# EAGLE design ATMega8Motherboard (EAGLE 6.2)
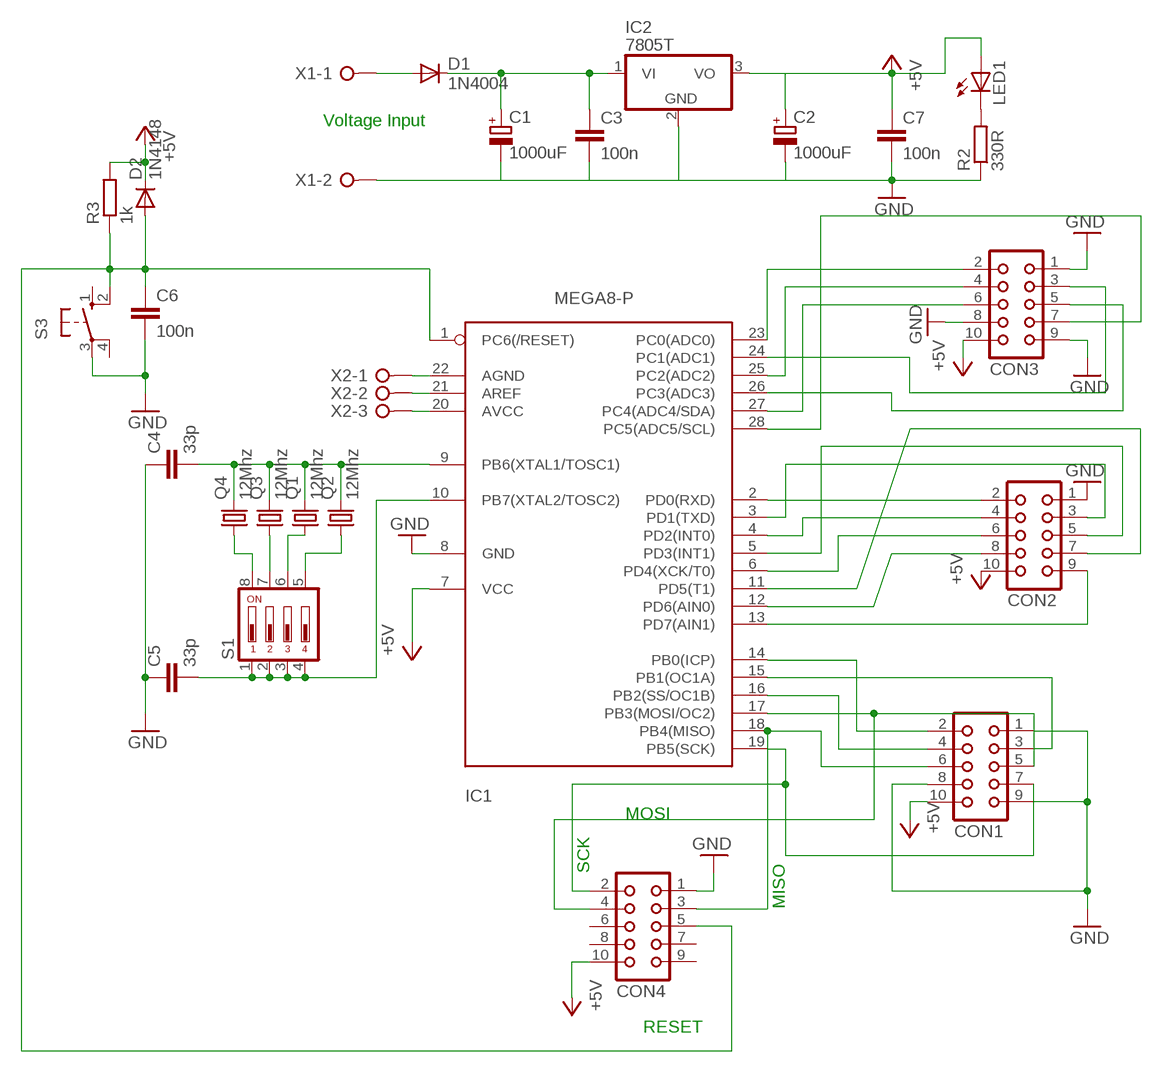
[diagram p0: schematic, sheet 1]

## Parts
C1  1000uF  CPOL-EUE2.5-7  [E2,5-7]
C2  1000uF  CPOL-EUE2.5-7  [E2,5-7]
C3  100n  C-EU025-024X044  [C025-024X044]
C4  33p  C-EU025-024X044  [C025-024X044]
C5  33p  C-EU025-024X044  [C025-024X044]
C6  100n  C-EU025-024X044  [C025-024X044]
C7  100n  C-EU025-024X044  [C025-024X044]
CON1  CON10  [CON10]
CON2  CON10  [CON10]
CON3  CON10  [CON10]
CON4  CON10  [CON10]
D1  1N4004  [DO41-10]
D2  1N4148  [DO35-10]
IC1  MEGA8-P  [DIL28-3]
IC2  7805T  [TO220H]
LED1  LED5MM  [LED5MM]
Q1  12Mhz  CRYSTALHC18U-V  [HC18U-V]
Q2  12Mhz  CRYSTALHC18U-V  [HC18U-V]
Q3  12Mhz  CRYSTALHC18U-V  [HC18U-V]
Q4  12Mhz  CRYSTALHC18U-V  [HC18U-V]
R2  330R  R-EU_0204/5  [0204/5]
R3  1k  R-EU_0204/5  [0204/5]
S1  DIP04YL  [DIP04YL]
S3  10-XX  [B3F-10XX]
X1  W237-02P  [W237-132]
X2  W237-03P  [W237-133]

## Nets
+5V: C2.+ C7.1 CON1.10 CON2.10 CON3.10 CON4.10 D2.C IC1.7(VCC) IC2.3(VO) LED1.A R3.2
GND: C1.- C2.- C3.2 C4.1 C5.1 C6.2 C7.2 CON1.1 CON1.8 CON1.9 CON2.1 CON3.1 CON3.8 CON3.9 CON4.1 IC1.8(GND) IC2.2(GND) R2.1 S3.3(P) X1.2
N$1: D1.A X1.1
N$2: C1.+ C3.1 D1.C IC2.1(VI)
N$3: CON1.3 IC1.15(PB1(OC1A))
N$4: CON2.2 IC1.2(PD0(RXD))
N$5: CON2.3 IC1.3(PD1(TXD))
N$6: CON1.2 IC1.14(PB0(ICP))
N$7: IC1.22(AGND) X2.1
N$8: CON2.4 IC1.4(PD2(INT0))
N$9: CON2.5 IC1.5(PD3(INT1))
N$10: CON2.6 IC1.6(PD4(XCK/T0))
N$11: CON3.4 IC1.25(PC2(ADC2))
N$12: IC1.21(AREF) X2.2
N$14: IC1.20(AVCC) X2.3
N$15: Q4.1 S1.8
N$16: Q3.1 S1.7
N$17: Q1.1 S1.6
N$18: Q2.1 S1.5
N$19: CON3.2 IC1.23(PC0(ADC0))
N$20: CON1.4 IC1.16(PB2(SS/OC1B))
N$21: LED1.K(C) R2.2
N$22: CON1.5 CON4.4 IC1.17(PB3(MOSI/OC2))
N$23: CON1.6 CON4.3 IC1.18(PB4(MISO))
N$24: CON1.7 CON4.2 IC1.19(PB5(SCK))
N$25: CON2.7 IC1.11(PD5(T1))
N$26: CON2.8 IC1.12(PD6(AIN0))
N$27: CON2.9 IC1.13(PD7(AIN1))
N$28: C5.2 IC1.10(PB7(XTAL2/TOSC2)) S1.1 S1.2 S1.3 S1.4
N$29: C4.2 IC1.9(PB6(XTAL1/TOSC1)) Q1.2 Q2.2 Q3.2 Q4.2
N$30: C6.1 CON4.5 D2.A IC1.1(PC6(/RESET)) R3.1 S3.2(S1)
N$31: CON3.3 IC1.24(PC1(ADC1))
N$32: CON3.5 IC1.26(PC3(ADC3))
N$33: CON3.6 IC1.27(PC4(ADC4/SDA))
N$34: CON3.7 IC1.28(PC5(ADC5/SCL))
Unconnected: CON4.6 CON4.7 CON4.8 CON4.9 S3.1(S) S3.4(P1)

## Notes on the sheet
- Voltage Input
- MOSI
- SCK
- MISO
- RESET

## Library data of the parts
C1 C2 = rcl:CPOL-EU: POLARIZED CAPACITOR, European symbol
C3-C7 = rcl:C-EU: CAPACITOR, European symbol
CON1-CON4 = con-harting:CON10: CONNECTOR
D1 = diode:1N4004: DIODE general purpose rectifier, 1 A
D2 = diode:1N4148: DIODE high speed (Philips)
IC1 = atmel:MEGA8-P: MICROCONTROLLER 8 Kbytes FLASH 1 kbytes SRAM 512 bytes EEPROM USART 4-channel 10 bit ADC 2-channel 8 bit ADC Source: avr.lbr
IC2 = linear:78*: Positive VOLTAGE REGULATOR Source: http://cache.national.com/ds/LM/LM78L05.pdf http://www.fairchildsemi.com/ds/LM/LM7805.pdf
LED1 = led:LED: LED OSRAM: - CHIPLED LG R971, LG N971, LY N971, LG Q971, LY Q971, LO R971, LY R971 LH N974, LH R974 LS Q976, LO Q976, LY Q976 LO Q996 - Hyper CHIPLED LW Q18S LB Q993, LB Q99A, LB R99A - SideLED LS A670, LO A670, LY A670, LG A670, LP A670 LB A673, LV A673, LT A673, LW A673 LH A674 LY A675 LS A676, LA A676, LO A676, LY A676, LW A676 LS A679, LY A679, LG A679 - Hyper Micro SIDELED® LS Y876, LA Y876, LO Y876, LY Y876 LT Y87S - SmartLED LW L88C, LW L88S LB L89C, LB L89S, LG L890 LS L89K, LO L89K, LY L89K LS L896, LA L896, LO L896, LY L896 - TOPLED LS T670, LO T670, LY T670, LG T670, LP T670 LSG T670, LSP T670, LSY T670, LOP T670, LYG T670 LG T671, LOG T671, LSG T671 LB T673, LV T673, LT T673, LW T673 LH T674 LS T676, LA T676, LO T676, LY T676, LB T676, LH T676, LSB T676, LW T676 LB T67C, LV T67C, LT T67C, LS T67K, LO T67K, LY T67K, LW E67C LS E67B, LA E67B, LO E67B, LY E67B, LB E67C, LV E67C, LT E67C LW T67C LS T679, LY T679, LG T679 LS T770, LO T770, LY T770, LG T770, LP T770 LB T773, LV T773, LT T773, LW T773 LH T774 LS E675, LA E675, LY E675, LS T675 LS T776, LA T776, LO T776, LY T776, LB T776 LHGB T686 LT T68C, LB T68C - Hyper Mini TOPLED® LB M676 - Mini TOPLED Santana® LG M470 LS M47K, LO M47K, LY M47K Source: http://www.osram.convergy.de - LUMILED® LXK2-PW12-R00, LXK2-PW12-S00, LXK2-PW14-U00, LXK2-PW14-V00 LXK2-PM12-R00, LXK2-PM12-S00, LXK2-PM14-U00 LXK2-PE12-Q00, LXK2-PE12-R00, LXK2-PE12-S00, LXK2-PE14-T00, LXK2-PE14-U00 LXK2-PB12-K00, LXK2-PB12-L00, LXK2-PB12-M00, LXK2-PB14-N00, LXK2-PB14-P00, LXK2-PB14-Q00 LXK2-PR12-L00, LXK2-PR12-M00, LXK2-PR14-Q00, LXK2-PR14-R00 LXK2-PD12-Q00, LXK2-PD12-R00, LXK2-PD12-S00 LXK2-PH12-R00, LXK2-PH12-S00 LXK2-PL12-P00, LXK2-PL12-Q00, LXK2-PL12-R00 Source: www.luxeon.com
Q1-Q4 = crystal:CRYSTAL: CRYSTAL
R2 R3 = rcl:R-EU_: RESISTOR, European symbol
S1 = switch-dil:DIP04YL: DIL/CODE SWITCH; OC_FARNELL: unknown; OC_NEWARK: unknown
S3 = switch-omron:10-XX: OMRON SWITCH; MPN: B3F-1000; OC_FARNELL: 176432; OC_NEWARK: 36M3542
X1 = con-wago-508:W237-02P: WAGO SREW CLAMP; OC_FARNELL: unknown; OC_NEWARK: unknown
X2 = con-wago-508:W237-03P: WAGO SREW CLAMP; OC_FARNELL: unknown; OC_NEWARK: unknown

## Board
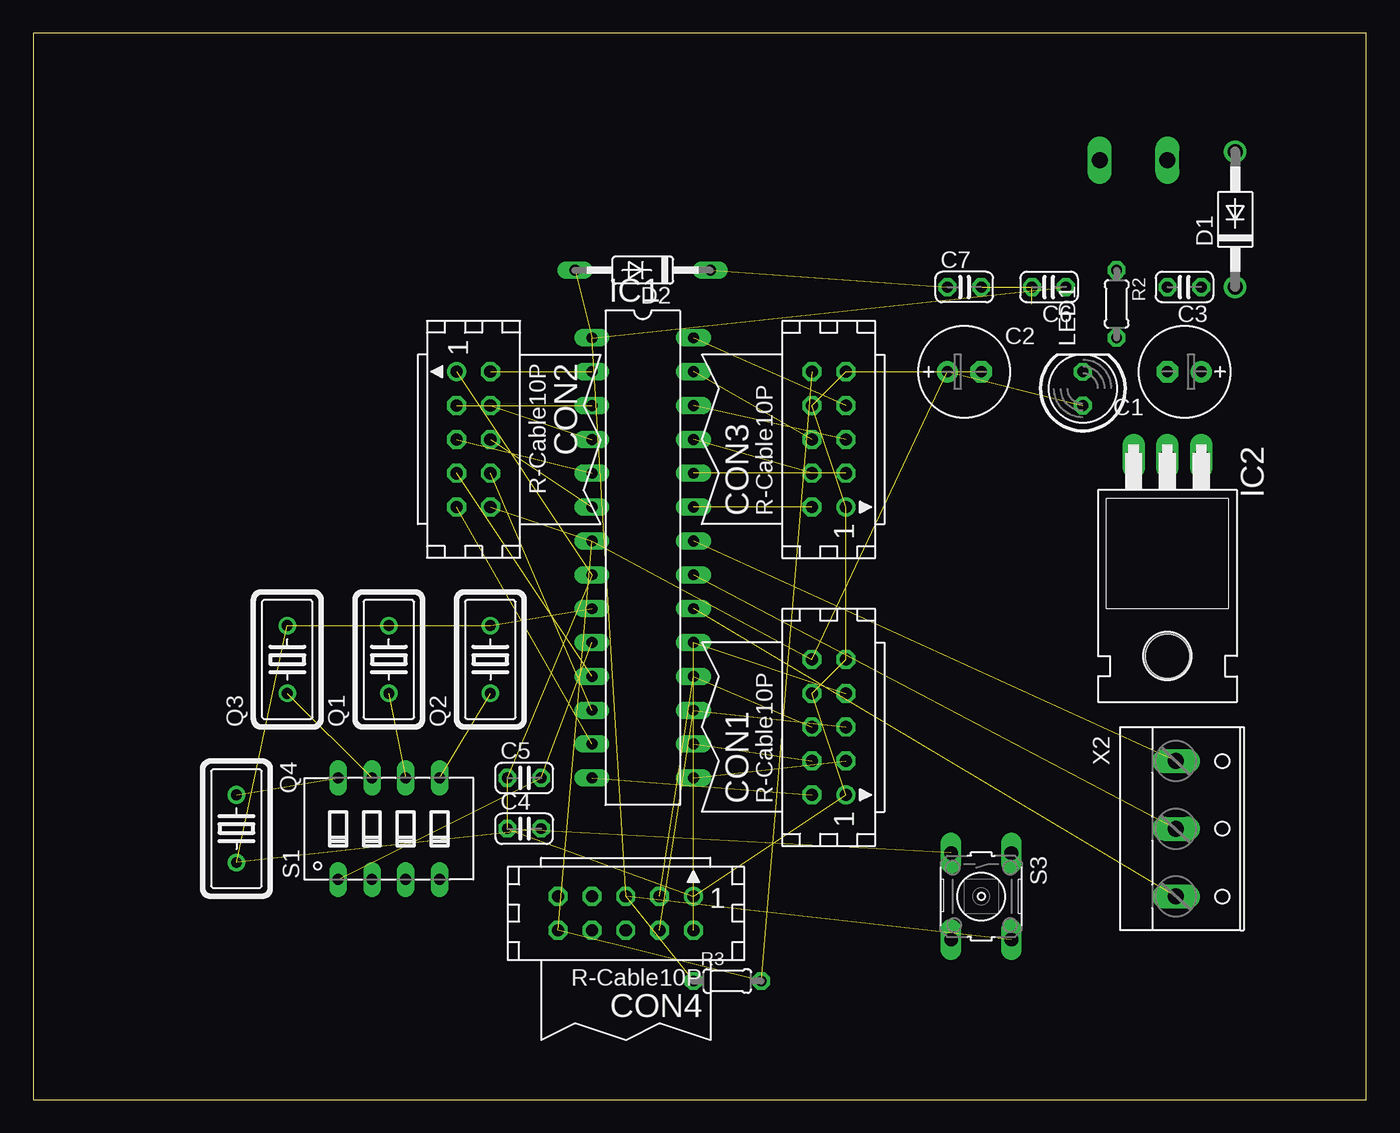
[diagram p1: board, top side]
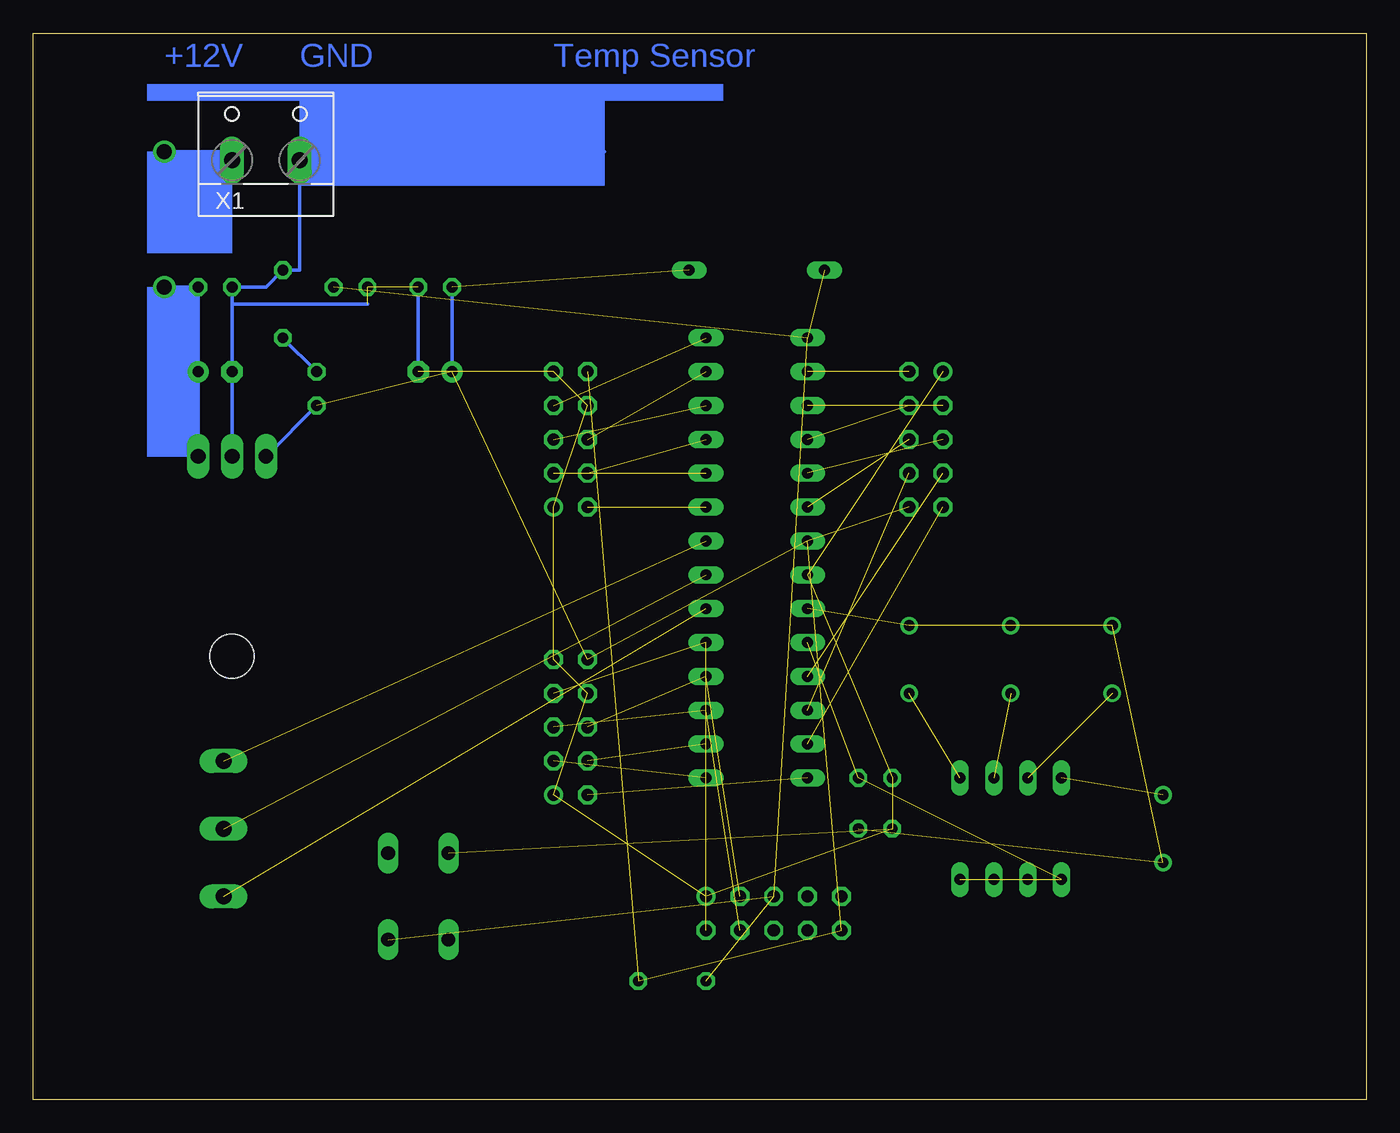
[diagram p2: board, bottom side, seen from below]

Size 100 x 80 mm. Coordinates in mm from the lower left corner, seen from the top.
Outline: 0,0 100,0 100,80 0,80 0,0
Copper layers (1*16): Top 0.035mm / dielectric 1.5mm / Bottom 0.035mm
Design rules: minimum track width 10mil, minimum drill 24mil, track to track 8mil, track to pad 8mil, pad to pad 8mil, via to via 8mil, smd to smd 8mil, copper to edge 40mil, drill to drill 8mil, minimum pad ring 10mil, minimum via ring 8mil, stop-mask expansion 4mil, vias tented up to drill 0mil, thermal gap 10mil

### Footprints (pad centres in the part's own frame; a part is rotated, then mirrored left to right if it is on the bottom)
E2,5-7 = drill 0.813 pad 1.6: + -1.27,0 | drill 0.813 pad 1.6 octagon: - 1.27,0
C025-024X044 = drill 0.813 octagon: 1 -1.27,0; 2 1.27,0
CON10 = drill 0.914: 1 -5.08,-1.27 | drill 0.914 octagon: 2 -5.08,1.27; 3 -2.54,-1.27; 4 -2.54,1.27; 5 0,-1.27; 6 0,1.27; 7 2.54,-1.27; 8 2.54,1.27; 9 5.08,-1.27; 10 5.08,1.27
DO41-10 = drill 1.118: A 5.08,0; C -5.08,0
DO35-10 = drill 0.813 long: A 5.08,0; C -5.08,0
DIL28-3 = drill 0.813 long: 1 -16.51,-3.81; 2 -13.97,-3.81; 3 -11.43,-3.81; 4 -8.89,-3.81; 5 -6.35,-3.81; 6 -3.81,-3.81; 7 -1.27,-3.81; 8 1.27,-3.81; 9 3.81,-3.81; 10 6.35,-3.81; 11 8.89,-3.81; 12 11.43,-3.81; 13 13.97,-3.81; 14 16.51,-3.81; 15 16.51,3.81; 16 13.97,3.81; 17 11.43,3.81; 18 8.89,3.81; 19 6.35,3.81; 20 3.81,3.81; 21 1.27,3.81; 22 -1.27,3.81; 23 -3.81,3.81; 24 -6.35,3.81; 25 -8.89,3.81; 26 -11.43,3.81; 27 -13.97,3.81; 28 -16.51,3.81
TO220H = drill 1.118 long: 1 -2.54,-10.16; 2 0,-10.16; 3 2.54,-10.16 | hole 3.302: 0,4.826
LED5MM = drill 0.813 octagon: A -1.27,0; K 1.27,0
HC18U-V = drill 0.813: 1 -2.54,0; 2 2.54,0
0204/5 = drill 0.813 octagon: 1 -2.54,0; 2 2.54,0
DIP04YL = drill 0.813 long: 1 -3.81,-3.81; 2 -1.27,-3.81; 3 1.27,-3.81; 4 3.81,-3.81; 5 3.81,3.81; 6 1.27,3.81; 7 -1.27,3.81; 8 -3.81,3.81
B3F-10XX = drill 1.016 long: 1 -3.251,2.261; 2 3.251,2.261; 3 -3.251,-2.261; 4 3.251,-2.261
W237-132 = drill 1.194 long: 1 -2.54,-0.635; 2 2.54,-0.635
W237-133 = drill 1.194 long: 1 -5.08,-0.635; 2 0,-0.635; 3 5.08,-0.635

### Placement (x,y rotation side)
C1  86.36,54.61 180 top
C2  69.85,54.61 0 top
C3  86.36,60.96 180 top
C4  36.83,20.32 0 top
C5  36.83,24.13 0 top
C6  76.2,60.96 180 top
C7  69.85,60.96 0 top
CON1  59.69,27.94 90 top
CON2  33.02,49.53 270 top
CON3  59.69,49.53 90 top
CON4  44.45,13.97 180 top
D1  90.17,66.04 90 top
D2  45.72,62.23 180 top
IC1  45.72,40.64 270 top
IC2  85.09,38.1 180 top
LED1  78.74,53.34 90 top
Q1  26.67,33.02 90 top
Q2  34.29,33.02 90 top
Q3  19.05,33.02 90 top
Q4  15.24,20.32 270 top
R2  81.28,59.69 270 top
R3  52.07,8.89 0 top
S1  26.67,20.32 0 top
S3  71.12,15.24 270 top
X1  82.55,71.12 0 bottom
X2  86.36,20.32 270 top

### Tracks (layer width: path | path; a pad name or v marks a point on that pad's centre or on a via)
+5V  (8 unrouted)
  Bottom 0.254: C7.1 C2.+ | IC2.3 LED1.A
GND  (14 unrouted)
  Bottom 0.254: C7.2 C2.- | 85.09,59.69 C3.2 82.55,60.96 R2.1 80.01,62.23 X1.2 80.01,71.12 57.15,71.12 | 85.09,59.69 C1.- IC2.2 | 85.09,59.69 74.93,59.69
N$1
  Bottom 0.254: D1.A 85.09,71.12 X1.1
N$2
  Bottom 0.254: D1.C C3.1 C1.+ IC2.1
N$3  (1 unrouted)
N$4  (1 unrouted)
N$5  (1 unrouted)
N$6  (1 unrouted)
N$7  (1 unrouted)
N$8  (1 unrouted)
N$9  (1 unrouted)
N$10  (1 unrouted)
N$11  (1 unrouted)
N$12  (1 unrouted)
N$14  (1 unrouted)
N$15  (1 unrouted)
N$16  (1 unrouted)
N$17  (1 unrouted)
N$18  (1 unrouted)
N$19  (1 unrouted)
N$20  (1 unrouted)
N$21
  Bottom 0.254: R2.2 LED1.K
N$22  (2 unrouted)
N$23  (2 unrouted)
N$24  (2 unrouted)
N$25  (1 unrouted)
N$26  (1 unrouted)
N$27  (1 unrouted)
N$28  (5 unrouted)
N$29  (5 unrouted)
N$30  (5 unrouted)
N$31  (1 unrouted)
N$32  (1 unrouted)
N$33  (1 unrouted)
N$34  (1 unrouted)
(copper drawn outside any net)
  shapes: Bottom area x5

### Text on the board
Bottom: Temp Sensor | GND | +12V